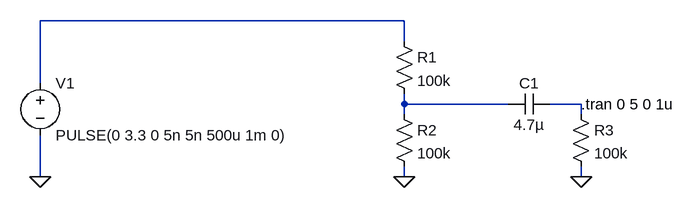
[diagram p0: schematic square-ac-coupling.asc]
square-ac-coupling.asc, the LTspice schematic file:
Version 4
SHEET 1 1152 680
WIRE 656 32 96 32
WIRE 656 64 656 32
WIRE 96 128 96 32
WIRE 656 160 656 144
WIRE 816 160 656 160
WIRE 928 160 880 160
WIRE 656 176 656 160
WIRE 928 176 928 160
WIRE 96 272 96 208
WIRE 656 272 656 256
WIRE 928 272 928 256
FLAG 96 272 0
FLAG 656 272 0
FLAG 928 272 0
SYMBOL voltage 96 112 R0
WINDOW 123 0 0 Left 0
WINDOW 39 0 0 Left 0
SYMATTR InstName V1
SYMATTR Value PULSE(0 3.3 0 5n 5n 500u 1m 0)
SYMBOL res 640 48 R0
SYMATTR InstName R1
SYMATTR Value 100k
SYMBOL res 640 160 R0
SYMATTR InstName R2
SYMATTR Value 100k
SYMBOL cap 880 144 R90
WINDOW 0 0 32 VBottom 2
WINDOW 3 32 32 VTop 2
SYMATTR InstName C1
SYMATTR Value 4.7µ
SYMBOL res 912 160 R0
SYMATTR InstName R3
SYMATTR Value 100k
TEXT 928 160 Left 2 !.tran 0 5 0 1u

The netlist it stands for:
* square-ac-coupling.asc
V1 N001 0 PULSE(0 3.3 0 5n 5n 500u 1m 0)
R1 N001 N002 100k
R2 N002 0 100k
C1 N003 N002 4.7µ
R3 N003 0 100k
.tran 0 5 0 1u
.backanno
.end